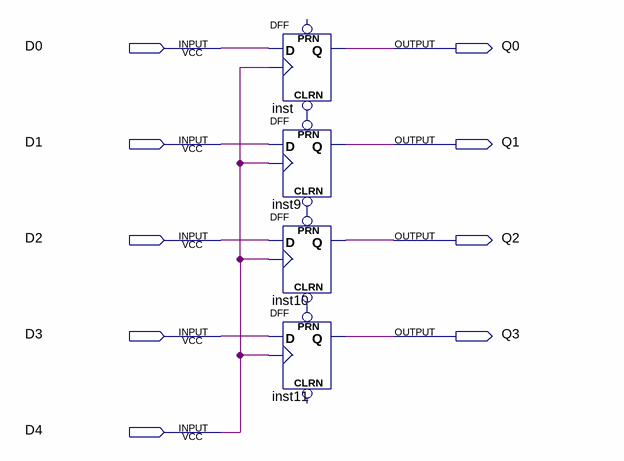
[diagram p0: schematic sheet]
// Quartus schematic lab5.bdf as structural Verilog: 4 symbols, 9 pins
module lab5 (
  input  D0,
  input  D1,
  input  D2,
  input  D3,
  input  D4,
  output Q0,
  output Q1,
  output Q2,
  output Q3
);

  wire undriven, undriven_2, undriven_3;

  DFF inst (.CLRN(undriven), .CLK(D4), .D(D0), .Q(Q0));  // open: PRN
  DFF inst9 (.CLRN(undriven_2), .CLK(D4), .D(D1), .PRN(undriven), .Q(Q1));
  DFF inst10 (.CLRN(undriven_3), .CLK(D4), .D(D2), .PRN(undriven_2), .Q(Q2));
  DFF inst11 (.CLK(D4), .D(D3), .PRN(undriven_3), .Q(Q3));  // open: CLRN
endmodule
